# EAGLE design cyberspace-1-ram-rom-card (EAGLE 9.6.2)
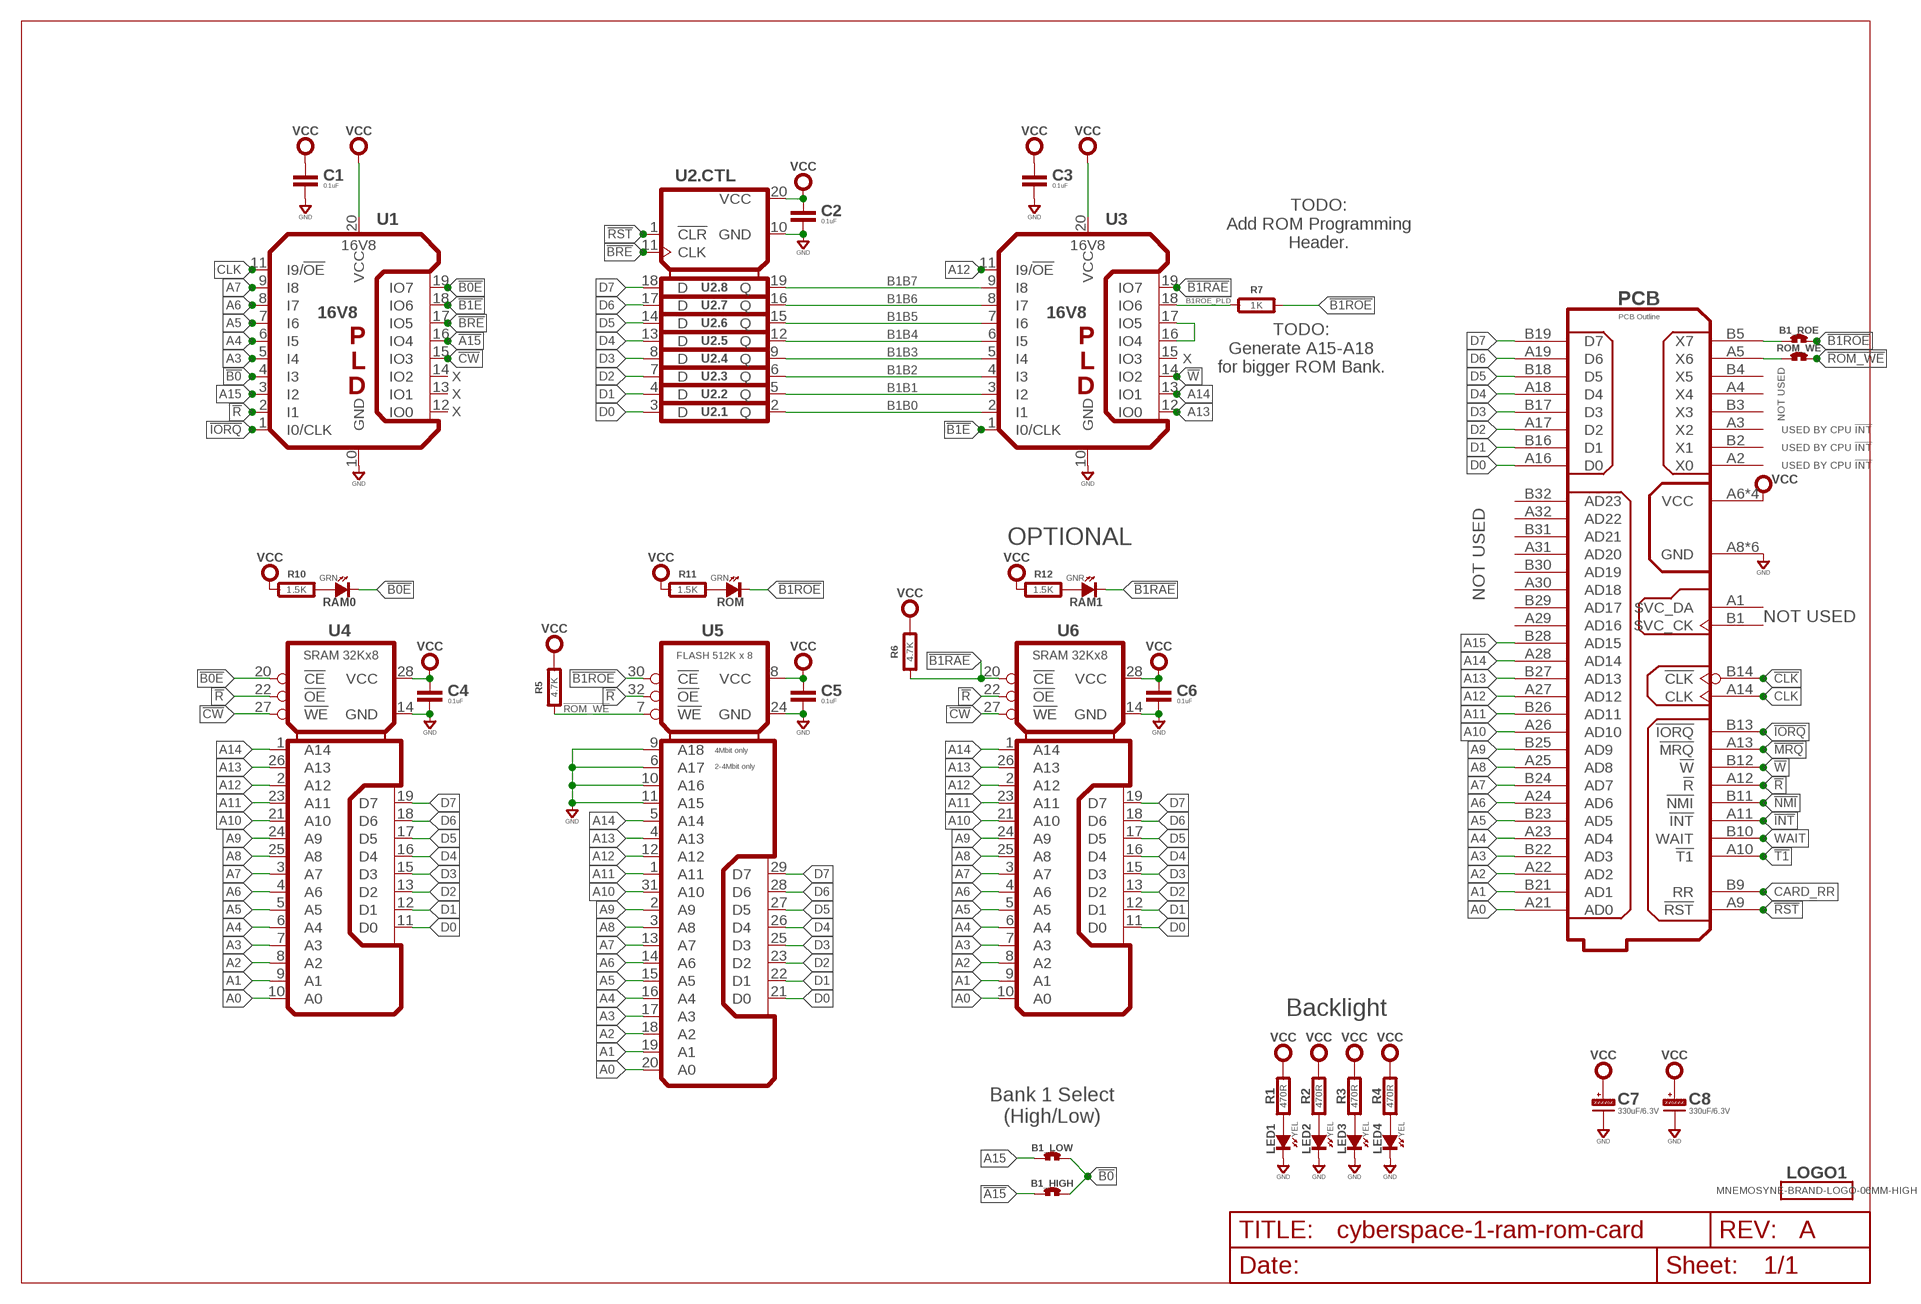
[diagram p0: schematic, sheet 1]
U$1 (DINA4_L-SMALLDOC): REV: A

## Parts
B1_HIGH  SOLDER_JUMPER-60MIL-RND  [SOLDER_JUMP_60MIL_RND]
B1_LOW  SOLDER_JUMPER-60MIL-RND  [SOLDER_JUMP_60MIL_RND]
B1_ROE  SOLDER_JUMPER-60MIL-RND  [SOLDER_JUMP_60MIL_RND]
C1  0.1uF  CAPACITOR0603  [0603-CAP]
C2  0.1uF  CAPACITOR0603  [0603-CAP]
C3  0.1uF  CAPACITOR0603  [0603-CAP]
C4  0.1uF  CAPACITOR0603  [0603-CAP]
C5  0.1uF  CAPACITOR0603  [0603-CAP]
C6  0.1uF  CAPACITOR0603  [0603-CAP]
C7  330uF/6.3V  CAPACITOR_POL-ALUM-SMT-6.3  [CAP_ALUM_SMT_6.3]
C8  330uF/6.3V  CAPACITOR_POL-ALUM-SMT-6.3  [CAP_ALUM_SMT_6.3]
LED1  YEL  SMT0603  [SMD_0603]
LED2  YEL  SMT0603  [SMD_0603]
LED3  YEL  SMT0603  [SMD_0603]
LED4  YEL  SMT0603  [SMD_0603]
LOGO1  MNEMOSYNE-BRAND-LOGO-06MM-HIGH  [MNEMOSYNE-06MM]
PCB  PCB Outline  CYBERSPACE-1-CARD-1A  [CYBERSPACE-CARD-TYPE-1A]
R1  470R  RESISTOR0603  [0603-RES]
R2  470R  RESISTOR0603  [0603-RES]
R3  470R  RESISTOR0603  [0603-RES]
R4  470R  RESISTOR0603  [0603-RES]
R5  4.7K  RESISTOR0603  [0603-RES]
R6  4.7K  RESISTOR0603  [0603-RES]
R7  1K  RESISTOR0603  [0603-RES]
R10  1.5K  RESISTOR0603  [0603-RES]
R11  1.5K  RESISTOR0603  [0603-RES]
R12  1.5K  RESISTOR0603  [0603-RES]
RAM0  GRN  SMT0603  [SMD_0603]
RAM1  GNR  SMT0603  [SMD_0603]
ROM  GRN  SMT0603  [SMD_0603]
ROM_WE  SOLDER_JUMPER-60MIL-RND  [SOLDER_JUMP_60MIL_RND]
U1  16V8  16V8-SOIC  [SOP20]
U2  74AHCT273NS  [SO20]
U3  16V8  16V8-SOIC  [SOP20]
U4  SRAM 32Kx8  62C256UL  [SOP28-330W]
U5  FLASH 512K x 8  FLASH_512KX8-512K-TSOP  [TSOP32-14X8MM]
U6  SRAM 32Kx8  62C256UL  [SOP28-330W]

## Nets
!A15: B1_HIGH.1 U1.16(IO4)
!B0: B1_HIGH.2 B1_LOW.2 U1.4(I3)
!B0E: RAM0.K(C) U1.19(IO7) U4.20(!CE)
!B1E: U1.18(IO6) U3.1(I0/CLK)
!B1RAE: R6.1 RAM1.K(C) U3.19(IO7) U6.20(!CE)
!B1ROE: B1_ROE.2 R7.2 ROM.K(C) U5.30(!CE)
!B1ROE_PLD: R7.1 U3.18(IO6)
!BRE: U1.17(IO5) U2.11(.CTL:CLK)
!CLK: PCB.B14(!CLK)
!CW: U1.15(IO3) U4.27(!WE) U6.27(!WE)
!INT: PCB.A11(!INT)
!IORQ: PCB.B13(!IORQ) U1.1(I0/CLK)
!MRQ: PCB.A13(!MRQ)
!NMI: PCB.B11(!NMI)
!R: PCB.A12(!R) U1.2(I1) U4.22(!OE) U5.32(!OE) U6.22(!OE)
!ROM_WE: R5.1 ROM_WE.2 U5.7(!WE)
!RST: PCB.A9(!RST) U2.1(.CTL:!CLR)
!T1: PCB.A10(!T1)
!W: PCB.B12(!W) U3.14(IO2)
A0: PCB.A21(AD0) U4.10(A0) U5.20(A0) U6.10(A0)
A1: PCB.B21(AD1) U4.9(A1) U5.19(A1) U6.9(A1)
A2: PCB.A22(AD2) U4.8(A2) U5.18(A2) U6.8(A2)
A3: PCB.B22(AD3) U1.5(I4) U4.7(A3) U5.17(A3) U6.7(A3)
A4: PCB.A23(AD4) U1.6(I5) U4.6(A4) U5.16(A4) U6.6(A4)
A5: PCB.B23(AD5) U1.7(I6) U4.5(A5) U5.15(A5) U6.5(A5)
A6: PCB.A24(AD6) U1.8(I7) U4.4(A6) U5.14(A6) U6.4(A6)
A7: PCB.B24(AD7) U1.9(I8) U4.3(A7) U5.13(A7) U6.3(A7)
A8: PCB.A25(AD8) U4.25(A8) U5.3(A8) U6.25(A8)
A9: PCB.B25(AD9) U4.24(A9) U5.2(A9) U6.24(A9)
A10: PCB.A26(AD10) U4.21(A10) U5.31(A10) U6.21(A10)
A11: PCB.B26(AD11) U4.23(A11) U5.1(A11) U6.23(A11)
A12: PCB.A27(AD12) U3.11(I9/!OE) U4.2(A12) U5.12(A12) U6.2(A12)
A13: PCB.B27(AD13) U3.12(IO0) U4.26(A13) U5.4(A13) U6.26(A13)
A14: PCB.A28(AD14) U3.13(IO1) U4.1(A14) U5.5(A14) U6.1(A14)
A15: B1_LOW.1 PCB.B28(AD15) U1.3(I2)
B1B0: U2.2(.1:Q) U3.2(I1)
B1B1: U2.5(.2:Q) U3.3(I2)
B1B2: U2.6(.3:Q) U3.4(I3)
B1B3: U2.9(.4:Q) U3.5(I4)
B1B4: U2.12(.5:Q) U3.6(I5)
B1B5: U2.15(.6:Q) U3.7(I6)
B1B6: U2.16(.7:Q) U3.8(I7)
B1B7: U2.19(.8:Q) U3.9(I8)
CARD_RR: PCB.B9(RR)
CLK: PCB.A14(CLK) U1.11(I9/!OE)
D0: PCB.A16(D0) U2.3(.1:D) U4.11(D0) U5.21(D0) U6.11(D0)
D1: PCB.B16(D1) U2.4(.2:D) U4.12(D1) U5.22(D1) U6.12(D1)
D2: PCB.A17(D2) U2.7(.3:D) U4.13(D2) U5.23(D2) U6.13(D2)
D3: PCB.B17(D3) U2.8(.4:D) U4.15(D3) U5.25(D3) U6.15(D3)
D4: PCB.A18(D4) U2.13(.5:D) U4.16(D4) U5.26(D4) U6.16(D4)
D5: PCB.B18(D5) U2.14(.6:D) U4.17(D5) U5.27(D5) U6.17(D5)
D6: PCB.A19(D6) U2.17(.7:D) U4.18(D6) U5.28(D6) U6.18(D6)
D7: PCB.B19(D7) U2.18(.8:D) U4.19(D7) U5.29(D7) U6.19(D7)
GND: C1.2 C2.2 C3.2 C4.2 C5.2 C6.2 C7.-(N) C8.-(N) LED1.K(C) LED2.K(C) LED3.K(C) LED4.K(C) PCB.A8(GND) PCB.A15(GND) PCB.A20(GND) PCB.B8(GND) PCB.B15(GND) PCB.B20(GND) U1.10(GND) U2.10(.CTL:GND) U3.10(GND) U4.14(GND) U5.6(A17) U5.9(A18) U5.10(A16) U5.11(A15) U5.24(GND) U6.14(GND)
N$1: U3.16(IO4) U3.17(IO5)
N$2: LED1.A R1.1
N$3: LED2.A R2.1
N$4: R10.2 RAM0.A
N$5: LED3.A R3.1
N$6: LED4.A R4.1
N$7: R11.2 ROM.A
N$8: R12.2 RAM1.A
N$9: B1_ROE.1 PCB.B5(X7)
N$10: PCB.A5(X6) ROM_WE.1
VCC: C1.1 C2.1 C3.1 C4.1 C5.1 C6.1 C7.+(P) C8.+(P) PCB.A6(VCC) PCB.A7(VCC) PCB.B6(VCC) PCB.B7(VCC) R1.2 R2.2 R3.2 R4.2 R5.2 R6.2 R10.1 R11.1 R12.1 U1.20(VCC) U2.20(.CTL:VCC) U3.20(VCC) U4.28(VCC) U5.8(VCC) U6.28(VCC)
WAIT: PCB.B10(WAIT)
Unconnected: PCB.A1(SVC_DA) PCB.A2(X0) PCB.A3(X2) PCB.A4(X4) PCB.A29(AD16) PCB.A30(AD18) PCB.A31(AD20) PCB.A32(AD22) PCB.B1(SVC_CK) PCB.B2(X1) PCB.B3(X3) PCB.B4(X5) PCB.B29(AD17) PCB.B30(AD19) PCB.B31(AD21) PCB.B32(AD23) U1.12(IO0) U1.13(IO1) U1.14(IO2) U3.15(IO3)

## Notes on the sheet
- TODO:
  Add ROM Programming
  Header.
- TODO:
  Generate A15-A18
  for bigger ROM Bank.
- X
- X
  X
  X
- NOT USED
- USED BY CPU !INT
- USED BY CPU !INT
- USED BY CPU !INT
- OPTIONAL
- NOT USED
- NOT USED
- Backlight
- Bank 1 Select
  (High/Low)

## Library data of the parts
B1_HIGH B1_LOW B1_ROE ROM_WE = rlc:SOLDER_JUMPER: Solder Jumper 60mil (2mm dia.), Round
C1-C6 = rlc:CAPACITOR: Capacitor; COST01: 0.12; COST10: 0.09; COST100: 0.05
C7 C8 = rlc:CAPACITOR_POL: Polarized Capacitor; COST01: 0.52; COST10: 0.35; COST100: 0.22
LED1-LED4 RAM0 RAM1 ROM = led:SMT: LED SMT; COST01: 0.20; COST10: 0.17; COST100: 0.14
LOGO1 = gfx-glyphs:MNEMOSYNE-BRAND-LOGO: Mnemosyne Brand Logo
PCB = con-edge:CYBERSPACE-1-CARD: Card for the CyberSpace 1 System
R1-R7 R10-R12 = rlc:RESISTOR: Resistor; COST01: 0.10; COST10: 0.05; COST100: 0.02
U1 U3 = logic:16V8: 16V8 Programmable Logic Device (PLD); COST01: 1.30; COST10: 1.15; COST100: 1.10; MFR: Atmel; MPN: AF16V8B15SU
U2 = logic:74*273?: Octal D-type Flip Flop
U4 U6 = logic:62*256: SRAM - 32Kx8 (256K); COST01: 1.50; COST10: 1.23; COST100: 1.10; MFR: ISSI; MPN: IS62C256AL-45UL
U5 = logic:FLASH_512KX8: Flash - 8 bit parallel, up to 512Kx8; COST01: 2.30; COST10: 2.10; COST100: 1.80; MFR: Microchip; MPN: SST39SF040-70-4C-Wxx

## Board
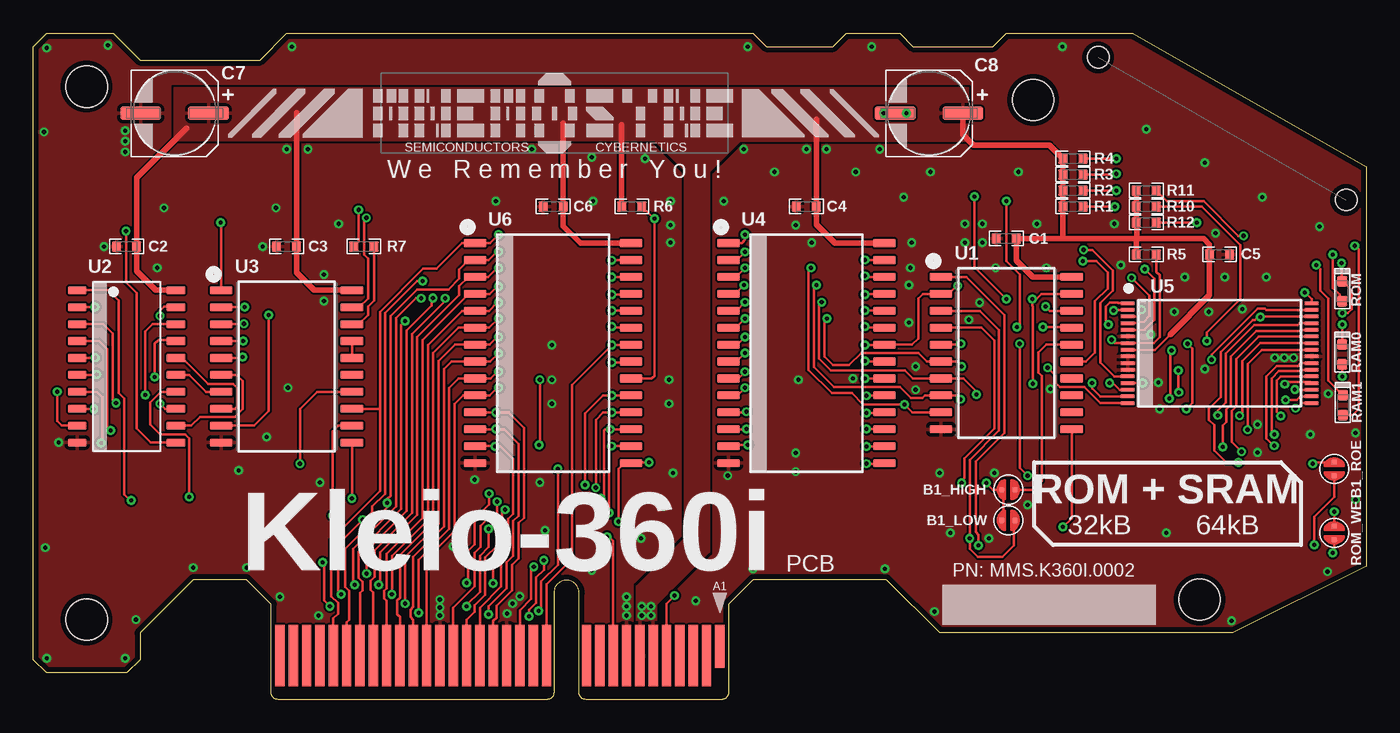
[diagram p1: board, top side]
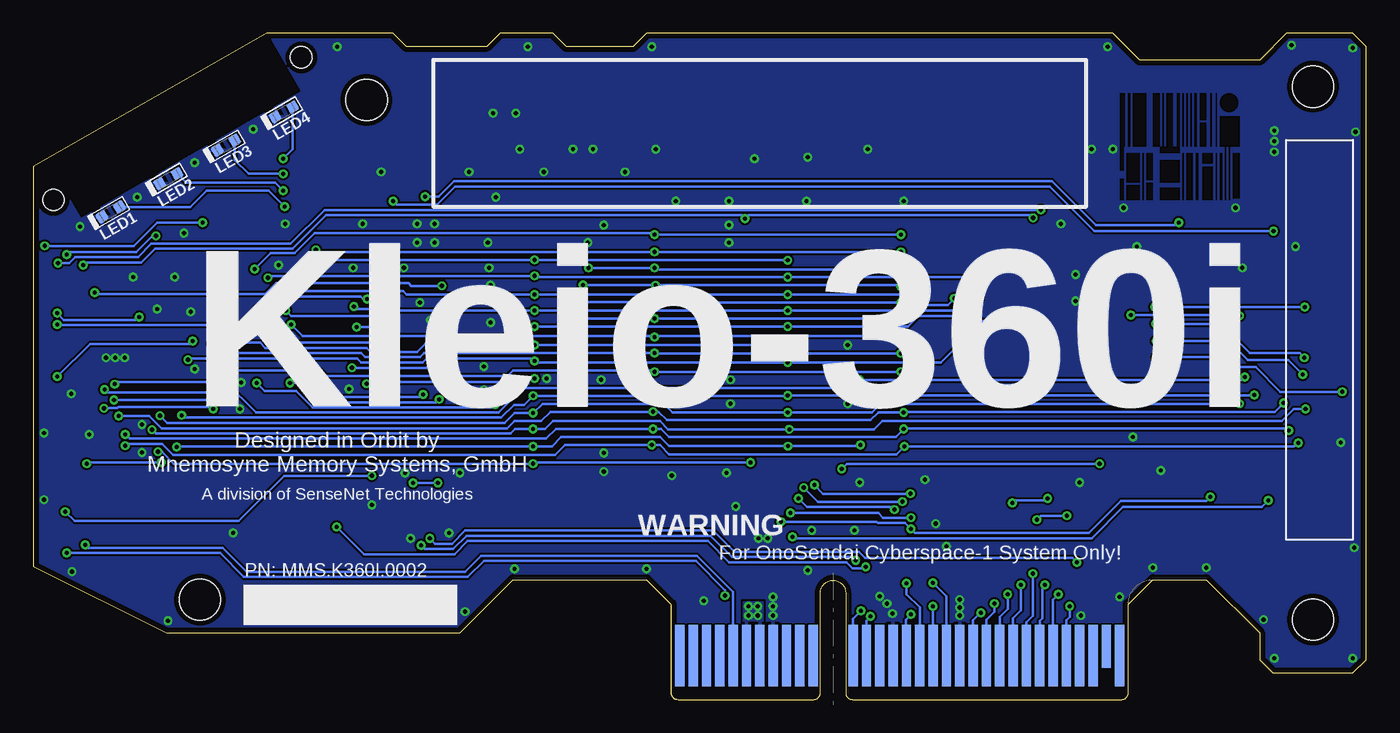
[diagram p2: board, bottom side, seen from below]

Size 100 x 50 mm. Coordinates in mm from the lower left corner, seen from the top.
Copper layers (1*16): Top 0.0356mm / dielectric 1.5011mm / Bottom 0.0356mm
Design rules "OSH-CircuitMonkey": minimum track width 6mil, minimum drill 12mil, track to track 6mil, track to pad 6mil, pad to pad 6mil, via to via 6mil, smd to smd 6mil, copper to edge 15mil, drill to drill 6mil, minimum pad ring 7mil, minimum via ring 7mil, stop-mask expansion 3mil, vias tented up to drill 13mil, thermal gap 10mil
Holes 1.6 mm at 79.9,48.2 98.5,37.5
bRestrict: area 79.9,36.2 to 98.7,49.5; area 18.1,41.5 to 18.5,45.5; area 16.5,41.5 to 17.5,45.5; area 15.5,41.5 to 16,45.5; area 14.5,41.5 to 15,45.5; area 12,43.5 to 12.5,45.5; area 9.5,41.5 to 11,43.8; area 17,37.5 to 18,38.6; area 16,39 to 16.5,41; area 14,41 to 15.5,41.5; area 13,37.5 to 13.5,41; area 11.5,37.5 to 12.3,40; area 9.5,37.6 to 10,41; area 17.7,41.5 to 17.9,45.5; area 15.2,41.4 to 15.3,45.5; area 14,41.5 to 14.2,45.5; area 13.1,41.5 to 13.2,45.5; area 12.7,41.5 to 12.9,45.5; area 13.4,41.5 to 13.5,45.5; area 13.7,41.5 to 13.8,45.5; area 11.2,41.5 to 11.3,45.5; area 11.6,41.5 to 11.7,45.5; area 13.7,37.5 to 13.8,41; area 12.6,37.5 to 12.8,41; area 11.2,37.5 to 11.3,41; area 10.8,37.5 to 11,41; area 10.5,37.5 to 10.6,41.5; area 10.2,37.5 to 10.3,41.5; area 18.2,39.7 to 18.5,41.5; area 18.2,37.5 to 18.5,39.1; area 16,37.5 to 16.5,38.8; area 17,38.8 to 18,41; area 16.7,37.5 to 16.8,41; area 12,41.5 to 12.5,43.3; area 11.5,40.2 to 12.3,41; area 14,38.8 to 15.5,40.5; area 14,37.5 to 15.5,38.4; area 9.6,44.1 to 11,45.5

### Footprints (pad centres in the part's own frame; a part is rotated, then mirrored left to right if it is on the bottom)
SOLDER_JUMP_60MIL_RND = smd 0.406 x 0.406: 1 -0.508,0; 2 0.508,0
0603-CAP = smd 0.711 x 0.762: 1 -0.752,0; 2 0.752,0
CAP_ALUM_SMT_6.3 = smd 3.048 x 1.016: + 2.54,0; - -2.54,0
SMD_0603 = smd 0.8 x 0.8: A 0.75,0; K -0.75,0
CYBERSPACE-CARD-TYPE-1A = smd 0.7 x 3.2: A1 11.5,4 | smd 0.7 x 4.6: A2 10.5,3.3; A3 9.5,3.3; A4 8.5,3.3; A5 7.5,3.3; A6 6.5,3.3; A7 5.5,3.3; A8 4.5,3.3; A9 3.5,3.3; A10 2.5,3.3; A11 1.5,3.3; A12 -1.5,3.3; A13 -2.5,3.3; A14 -3.5,3.3; A15 -4.5,3.3; A16 -5.5,3.3; A17 -6.5,3.3; A18 -7.5,3.3; A19 -8.5,3.3; A20 -9.5,3.3; A21 -10.5,3.3; A22 -11.5,3.3; A23 -12.5,3.3; A24 -13.5,3.3; A25 -14.5,3.3; A26 -15.5,3.3; A27 -16.5,3.3; A28 -17.5,3.3; A29 -18.5,3.3; A30 -19.5,3.3; A31 -20.5,3.3; A32 -21.5,3.3 | smd 0.7 x 4.6 bottom: B1 11.5,3.3; B2 10.5,3.3; B3 9.5,3.3; B4 8.5,3.3; B5 7.5,3.3; B6 6.5,3.3; B7 5.5,3.3; B8 4.5,3.3; B9 3.5,3.3; B10 2.5,3.3; B11 1.5,3.3; B12 -1.5,3.3; B13 -2.5,3.3; B14 -3.5,3.3; B15 -4.5,3.3; B16 -5.5,3.3; B17 -6.5,3.3; B18 -7.5,3.3; B19 -8.5,3.3; B20 -9.5,3.3; B21 -10.5,3.3; B22 -11.5,3.3; B23 -12.5,3.3; B24 -13.5,3.3; B25 -14.5,3.3; B26 -15.5,3.3; B27 -16.5,3.3; B28 -17.5,3.3; B29 -18.5,3.3; B30 -19.5,3.3; B32 -21.5,3.3 | smd 0.7 x 3.2 bottom: B31 -20.5,4 | hole 3.1: -36,46; -36,6; 47.5,7.5; 35,45
0603-RES = smd 0.711 x 0.762: 1 -0.752,0; 2 0.752,0
SOP20 = smd 0.6 x 1.7: 1 -5.715,-4.9; 2 -4.445,-4.9; 3 -3.175,-4.9; 4 -1.905,-4.9; 5 -0.635,-4.9; 6 0.635,-4.9; 7 1.905,-4.9; 8 3.175,-4.9; 9 4.445,-4.9; 10 5.715,-4.9; 11 5.715,4.9; 12 4.445,4.9; 13 3.175,4.9; 14 1.905,4.9; 15 0.635,4.9; 16 -0.635,4.9; 17 -1.905,4.9; 18 -3.175,4.9; 19 -4.445,4.9; 20 -5.715,4.9
SO20 = smd 0.6 x 1.4: 1 -5.715,-3.7; 2 -4.445,-3.7; 3 -3.175,-3.7; 4 -1.905,-3.7; 5 -0.635,-3.7; 6 0.635,-3.7; 7 1.905,-3.7; 8 3.175,-3.7; 9 4.445,-3.7; 10 5.715,-3.7; 11 5.715,3.7; 12 4.445,3.7; 13 3.175,3.7; 14 1.905,3.7; 15 0.635,3.7; 16 -0.635,3.7; 17 -1.905,3.7; 18 -3.175,3.7; 19 -4.445,3.7; 20 -5.715,3.7
SOP28-330W = smd 0.6 x 1.7: 1 -8.255,-5.85; 2 -6.985,-5.85; 3 -5.715,-5.85; 4 -4.445,-5.85; 5 -3.175,-5.85; 6 -1.905,-5.85; 7 -0.635,-5.85; 8 0.635,-5.85; 9 1.905,-5.85; 10 3.175,-5.85; 11 4.445,-5.85; 12 5.715,-5.85; 13 6.985,-5.85; 14 8.255,-5.85; 15 5.715,5.85; 16 4.445,5.85; 17 8.255,5.85; 18 6.985,5.85; 19 3.175,5.85; 20 1.905,5.85; 21 0.635,5.85; 22 -0.635,5.85; 23 -1.905,5.85; 24 -3.175,5.85; 25 -4.445,5.85; 26 -5.715,5.85; 27 -6.985,5.85; 28 -8.255,5.85
TSOP32-14X8MM = smd 0.27 x 1.1: 1 -3.75,-6.9; 2 -3.25,-6.9; 3 -2.75,-6.9; 4 -2.25,-6.9; 5 -1.75,-6.9; 6 -1.25,-6.9; 7 -0.75,-6.9; 8 -0.25,-6.9; 9 0.25,-6.9; 10 0.75,-6.9; 11 1.25,-6.9; 12 1.75,-6.9; 13 2.25,-6.9; 14 2.75,-6.9; 15 3.25,-6.9; 16 3.75,-6.9; 17 3.75,6.9; 18 3.25,6.9; 19 2.75,6.9; 20 2.25,6.9; 21 1.75,6.9; 22 1.25,6.9; 23 0.75,6.9; 24 0.25,6.9; 25 -0.25,6.9; 26 -0.75,6.9; 27 -1.25,6.9; 28 -1.75,6.9; 29 -2.25,6.9; 30 -2.75,6.9; 31 -3.25,6.9; 32 -3.75,6.9

### Placement (x,y rotation side)
B1_HIGH  73.15,15.75 180 top
B1_LOW  73.15,13.45 180 top
B1_ROE  97.6,17.3 90 top
C1  73,34.6 180 top
C2  7,34 180 top
C3  19,34 180 top
C4  58,37 180 top
C5  89,33.4 0 top
C6  39,37 180 top
C7  10.6,44 0 top
C8  67.2,44 0 top
LED1  94.19,36.6 30 bottom
LED2  89.86,39.1 30 bottom
LED3  85.53,41.6 30 bottom
LED4  81.2,44.1 30 bottom
LOGO1  39.1,44 0 top
PCB  40,0 0 top
R1  78,37 180 top
R2  78,38.2 180 top
R3  78,39.4 180 top
R4  78,40.6 180 top
R5  83.5,33.4 180 top
R6  44.9,37 180 top
R7  24.8,34 180 top
R10  83.5,37 0 top
R11  83.5,38.2 0 top
R12  83.5,35.8 0 top
RAM0  98.2,25.9 270 top
RAM1  98.25,22.1 270 top
ROM  98.2,30.65 270 top
ROM_WE  97.6,12.5 90 top
U1  73,26 270 top
U2  7,25 270 top
U3  19,25 270 top
U4  58,26 270 top
U5  89,26 270 top
U6  39,26 270 top

### Tracks (layer width: path | path; a pad name or v marks a point on that pad's centre or on a via)
!A15
  Top 0.2: U1.16 77.89,26.65 76,26.65 75.4,26.05 75.4,24.55 75.65,24.3 75.65,16.4 75,15.75 B1_HIGH.1
!B0  (via drill 0.3)
  Top 0.2: B1_LOW.2 72.79,13.6 72.79,15.6 B1_HIGH.2 72,15.75 v71.5,16.25 | v69.65,16.25 69.65,16.45 69.85,16.65 69.85,18.1 72.1,20.35 72.1,26.95 71.14,27.91 U1.4
  Bottom 0.2: v71.5,16.25 v69.65,16.25
!B0E  (via drill 0.3)
  Top 0.2: U4.20 v62.41,24.09 v62.4,24.1 | v98.2,28.15 RAM0.K | v75,23.7 75,29.5 74.95,29.55 v74.95,30.05 75.25,30.05 75.64,30.45 U1.19
  Bottom 0.2: v62.4,24.1 63.95,24.1 64.2,23.85 74.85,23.85 v75,23.7 | v98.2,28.15 98.15,28.1 82.85,28.1 82.5,28.45 82.5,29.3 81.55,30.25 75.45,30.25 75.25,30.05 v74.95,30.05
!B1E  (via drill 0.3)
  Top 0.2: U1.18 76.28,29.18 v75.95,29.5 | v73,30.07 70.6,32.47 v70.6,37.75 | v14.05,35.8 14.1,35.75 U3.1
  Bottom 0.2: v75.95,29.5 75.75,29.3 74.4,29.3 73.63,30.07 v73,30.07 | v70.6,37.75 69.6,37.75 68.45,38.9 23.6,38.9 20.3,35.6 14.25,35.6 v14.05,35.8
!B1RAE  (via drill 0.3)
  Top 0.2: R6.1 46.55,36.1 v46.6,36.1 46.6,24.3 46.4,24.09 U6.20 | U3.19 24.45,29.45 25.1,30.1 25.1,33.1 24.8,33.4 24.8,35.96 v24.99,36.15 | v96.25,32.6 96.55,32.3 96.55,30.7 97.15,30.1 97.15,23.95 RAM1.K
  Bottom 0.2: v24.99,36.15 25.19,36.35 46.35,36.35 v46.6,36.1 46.85,36.35 78.05,36.35 80.55,33.85 90.85,33.85 91.9,32.8 96.05,32.8 v96.25,32.6
!B1ROE  (via drill 0.3)
  Top 0.2: v98.15,32.75 98.15,31.45 ROM.K 98.9,30.7 98.9,29.3 98.6,29 v98.2,29 | U5.30 92.1,28.75 v92.05,28.7 91.85,28.7 91.65,28.5 91.5,28.5 89.1,26.1 89.1,22.7 88.2,21.8 88.2,21 88.6,20.6 88.6,18.7 89.51,17.79 v90.4,17.79 | v24.4,36.75 24.4,34.35 R7.2 | v96,17.7 96.11,17.81 B1_ROE.2
  Bottom 0.2: v98.15,32.75 97.3,32.75 96.85,33.2 92.15,33.2 91.15,34.2 80.7,34.2 78.15,36.75 v24.4,36.75 | v92.05,28.7 92.1,28.75 92.35,28.5 97.7,28.5 v98.2,29 | v90.4,17.79 95.91,17.79 v96,17.7
!B1ROE_PLD
  Top 0.2: R7.1 25.55,29.95 25.1,29.5 25.1,28.88 24.4,28.18 U3.18
!BRE  (via drill 0.3)
  Top 0.2: v73.8,27.95 74,28.15 74,31.9 73,32.9 v73,37.4 | v75.75,27.95 77.86,27.95 U1.17 | v6.95,35.15 6.95,31.3 7.75,30.5 7.75,20.35 8.81,19.29 U2.11
  Bottom 0.2: v73,37.4 72.75,37.15 69.7,37.15 68.35,38.5 23.75,38.5 20.4,35.15 v6.95,35.15 | v73.8,27.95 v75.75,27.95
!CW  (via drill 0.3)
  Top 0.2: U6.27 43.42,32.98 v43.4,32.97 | v62.4,33 63.84,33 U4.27 | v78.75,32.9 79.75,32.9 80.6,32.05 80.6,30.85 79.65,29.9 79.65,26.05 78.97,25.36 U1.15
  Bottom 0.2: v43.4,32.97 53.14,32.97 53.16,32.98 62.38,32.98 v62.4,33 78.65,33 v78.75,32.9
!IORQ  (via drill 0.3)
  Top 0.2: v70.9,11.57 70.9,12.37 70.7,12.57 70.7,17.87 72.85,20.02 72.85,28.85 70,31.7 68.11,31.7 U1.1 | v38.3,10.43 38.3,9.75 37.7,9.15 37.7,7.26 37.19,6.74 v37.19,6.24 v37.18,6.23
  Bottom 0.2: v70.9,11.57 70.63,11.3 68.5,11.3 67.5,12.3 49.2,12.3 47.6,10.7 38.57,10.7 v38.3,10.43 | PCB.B13 37.5,5.9 37.18,6.22 v37.18,6.23
!R  (via drill 0.3)
  Top 0.2: U6.22 44.83,26.62 v43.4,26.62 40.4,23.62 40.4,10.55 38.5,8.65 PCB.A12 | v62.4,26.6 63.81,26.6 U4.22 65.94,26.64 66.4,27.1 66.4,30.1 66.75,30.45 U1.2 68.64,30.45 69.25,31.05 v69.35,31.05 | v95.4,30.55 95.9,30.05 U5.32
  Bottom 0.2: v43.4,26.62 62.38,26.62 v62.4,26.6 | v69.35,31.05 71.65,31.05 71.85,31.25 81.8,31.25 82.6,30.45 95.3,30.45 v95.4,30.55
!ROM_WE  (via drill 0.3)
  Top 0.2: R5.1 84.25,32.1 84.5,31.85 84.5,27.2 84.05,26.75 U5.7 81.15,26.75 v80.9,27 | v74,26.7 74,20.5 74,20.4 74,17.4 v74.6,16.8 | v97.6,14.1 ROM_WE.2
  Bottom 0.2: v80.9,27 80.7,26.8 74.1,26.8 v74,26.7 | v74.6,16.8 81.2,16.8 84.6,13.4 96.9,13.4 v97.6,14.1
!RST  (via drill 0.3)
  Top 0.2: U2.1 5.63,30.71 6.4,29.95 6.4,23 6.8,22.6 6.8,15.4 7.25,14.95 v7.35,14.95 | v43.05,12.2 43.2,12.2 43.5,11.9 PCB.A9
  Bottom 0.2: v7.35,14.95 7.85,14.45 18.25,14.45 20.6,12.1 42.95,12.1 v43.05,12.2
!W  (via drill 0.3)
  Top 0.2: U3.14 21.3,23.09 20,21.8 v20,17.7 | v37.92,6.65 37.92,6.67 38.1,6.85 38.1,8.85 39.35,10.1 v39.35,17.3
  Bottom 0.2: v20,17.7 38.95,17.7 v39.35,17.3 | PCB.B12 38.5,6.06 v37.92,6.64 v37.92,6.65
A0  (via drill 0.3)
  Top 0.2: PCB.A21 29.5,10.55 31.6,12.65 31.6,22.2 32.23,22.82 U6.10 34.23,22.82 34.8,23.4 v34.9,23.4 | v53.4,23.4 52.83,22.82 U4.10 | U5.20 95.8,23.85 94.08,23.85 v93.9,23.67
  Bottom 0.2: v34.9,23.4 v53.4,23.4 63.25,23.4 65.1,21.55 83.3,21.55 85.59,23.84 93.73,23.84 v93.9,23.67
A1  (via drill 0.3)
  Top 0.2: v28.9,6.5 28.9,10.5 31.2,12.8 31.2,23.4 31.89,24.09 U6.9 34.3,24.09 34.8,24.6 v34.9,24.6 | U4.9 52.9,24.09 v53.4,24.6 | U5.19 v94.67,23.25 v94.66,23.26 | v85.95,23.06 85.9,23.11 v85.9,24.7
  Bottom 0.2: PCB.B21 29.5,5.95 28.95,6.5 v28.9,6.5 | v34.9,24.6 v53.4,24.6 53.5,24.7 64,24.7 64.4,24.3 78.05,24.3 78.45,24.7 v85.9,24.7 | v94.66,23.26 94.46,23.06 v85.95,23.06
A2  (via drill 0.3)
  Top 0.2: PCB.A22 28.5,6 28.3,6.2 28.3,6.75 28.5,6.95 28.5,10.7 30.8,13 30.8,24.8 31.36,25.36 U6.8 34.28,25.36 v34.9,25.98 | v53.4,26 52.77,25.36 U4.8 | U5.18 95.06,22.75 94.78,22.48 v93.95,22.48 | v85.4,26.2 85.3,26.1 85.3,22.65 v85.24,22.59
  Bottom 0.2: v34.9,25.98 53.38,25.98 v53.4,26 70.7,26 71,25.7 75.1,25.7 75.4,26 85.2,26 v85.4,26.2 | v93.95,22.48 85.42,22.48 85.31,22.59 v85.24,22.59
A3  (via drill 0.3)
  Top 0.2: v27.9,7.2 27.9,10.7 30.4,13.2 30.4,25.4 31.64,26.64 U6.7 34.23,26.64 34.8,27.2 v34.9,27.2 | U4.7 52.84,26.64 v53.4,27.2 | U5.17 95.15,22.25 94.8,21.9 94.74,21.9 v94.7,21.86 | v69.6,26.7 69.53,26.64 U1.5 | v86.6,26.7 86.95,26.35 86.95,22.25 v86.5,21.8
  Bottom 0.2: PCB.B22 28.5,6 27.9,6.6 v27.9,7.2 | v34.9,27.2 34.9,27.3 53.3,27.3 v53.4,27.2 53.5,27.3 63.4,27.3 64,26.7 v69.6,26.7 70.6,26.7 71.2,26.1 74.7,26.1 75,26.4 82.6,26.4 83,26.8 86.5,26.8 v86.6,26.7 | v94.7,21.86 93.7,21.86 93.6,21.96 86.66,21.96 v86.5,21.8 | v86.5,21.8
A4  (via drill 0.3)
  Top 0.2: PCB.A23 27.5,6.2 27.3,6.4 27.3,7.45 27.5,7.65 27.5,10.85 30,13.35 30,26 31.91,27.91 U6.6 34.2,27.91 v34.9,28.6 | v53.4,28.6 52.7,27.91 U4.6 | v59.55,28.6 59.35,28.4 59.35,25.75 60,25.1 61.2,25.1 62.12,26.02 66.4,26.02 67.05,25.36 U1.6 69.39,25.36 69.65,25.1 v69.65,25 | v76.1,24.9 76.7,24.3 76.7,23.75 77,23.45 78.85,23.45 80.05,22.25 U5.16
  Bottom 0.2: v34.9,28.6 v53.4,28.6 v59.55,28.6 | v76.1,24.9 70.55,24.9 70.25,25.2 69.85,25.2 v69.65,25
A5  (via drill 0.3)
  Top 0.2: v26.9,7.9 26.9,10.8 29.6,13.5 29.6,26.6 32.17,29.18 U6.5 34.17,29.18 34.8,29.8 v34.9,29.8 | v53.4,29.82 52.76,29.18 U4.5 | U5.15 80.05,22.75 79.44,23.36 v79.44,23.76 | v59.15,29.82 58.95,29.62 58.95,25.6 59.85,24.7 65.4,24.7 66,24.09 U1.7 69.79,24.09 70.75,23.13 v70.75,22.88
  Bottom 0.2: PCB.B23 27.5,6.2 26.9,6.8 v26.9,7.9 | v34.9,29.8 53.38,29.8 v53.4,29.82 v59.15,29.82 | v79.44,23.76 79.44,23.56 78.58,22.7 71.05,22.7 70.87,22.88 v70.75,22.88
A6  (via drill 0.3)
  Top 0.2: PCB.A24 26.5,7.4 26.3,7.6 26.3,8.15 26.5,8.35 26.5,10.95 29.2,13.65 29.2,27 32.65,30.45 U6.4 34.24,30.45 34.8,31 v34.9,31 | v53.31,31.09 52.66,30.45 U4.4 | v69.55,22.53 69.26,22.82 U1.8 66.9,22.82 66.7,22.62 65.83,22.62 65,23.45 60.05,23.45 58.55,24.95 58.55,30.9 v58.75,31.1 | v80.75,23.75 81,23.75 81.5,23.25 U5.14
  Bottom 0.2: v34.9,31 35,31.1 v53.3,31.1 v53.31,31.09 v58.75,31.1 | v69.55,22.53 69.78,22.3 78.8,22.3 80.25,23.75 v80.75,23.75
A7  (via drill 0.3)
  Top 0.2: v25.9,8.6 26,8.7 26,11.05 28.8,13.85 28.8,27.2 31.95,30.35 31.95,31.02 32.65,31.71 U6.3 34.13,31.71 34.8,32.38 v34.9,32.38 | v53.4,32.4 52.72,31.71 U4.3 | U1.9 65.94,21.55 v65.35,22.15 62.25,22.15 61.4,23 59.9,23 58.15,24.75 58.15,32.2 v58.35,32.4 | U5.13 v83.25,23.75
  Bottom 0.2: PCB.B24 26.5,6.1 25.9,6.7 v25.9,8.6 | v34.9,32.38 35,32.28 53.28,32.28 v53.4,32.4 v58.35,32.4 | v83.25,23.75 82.65,23.15 80.3,23.15 79.05,21.9 65.6,21.9 v65.35,22.15
A8  (via drill 0.3)
  Top 0.2: PCB.A25 25.5,8.05 25.3,8.25 25.3,8.9 25.6,9.2 25.6,11.2 28.4,14 28.4,27.42 30.89,29.91 v30.89,30.11 | U6.25 44.8,30.4 v43.4,30.4 | U4.25 62.45,30.45 v62.4,30.4 | v83.15,29.25 83.15,29.1 82.8,28.75 U5.3
  Bottom 0.2: v30.89,30.11 31.39,29.61 33.69,29.61 34.48,30.4 v43.4,30.4 v62.4,30.4 72,30.4 72.25,30.65 81.8,30.65 83.15,29.3 v83.15,29.25
A9  (via drill 0.3)
  Top 0.2: v25,9.45 25,11.15 28,14.15 28,27.68 29.88,29.55 29.88,30.02 v29.98,30.12 | v43.4,29.2 44.83,29.2 U6.24 | v62.4,29.2 63.83,29.2 U4.24 | v81.05,29.2 81.05,29.25 U5.2
  Bottom 0.2: PCB.B25 25.5,5.8 25,6.3 v25,9.45 | v29.98,30.12 30.9,29.2 v43.4,29.2 v62.4,29.2 73.55,29.2 73.95,28.8 80.65,28.8 v81.05,29.2
A10  (via drill 0.3)
  Top 0.2: PCB.A26 24.5,8 24.7,8.2 24.7,8.85 24.4,9.15 24.4,11.1 27.6,14.3 27.6,28.1 v27.9,28.4 | U6.21 44.78,25.3 v43.4,25.3 | U4.21 62.44,25.36 v62.4,25.4 | v88.4,25.5 88.4,25.9 91.85,29.35 92.4,29.35 92.5,29.25 U5.31
  Bottom 0.2: v27.9,28.4 28.8,28.4 31.9,25.3 v43.4,25.3 62.3,25.3 v62.4,25.4 62.6,25.6 70.5,25.6 70.8,25.3 75.4,25.3 75.7,25.6 88.3,25.6 v88.4,25.5
A11  (via drill 0.3)
  Top 0.2: v24.1,8.6 24,8.7 24,11.3 27.2,14.5 27.2,28.61 28.7,30.11 v29.1,30.11 | v43.4,28 43.4,27.95 43.45,27.91 U6.23 | U4.23 62.49,27.91 v62.4,28 | U5.1 81.4,29.75 81.35,29.8 80.75,29.8 80.45,29.5 80.45,28.35 v80.65,28.15
  Bottom 0.2: PCB.B26 24.5,5.9 24.3,6.1 24.3,8.4 v24.1,8.6 | v29.1,30.11 v29.1,30.1 30.4,28.8 33.6,28.8 34.4,28 v43.4,28 v62.4,28 63.5,28 64.22,27.28 79.78,27.28 v80.65,28.15
A12  (via drill 0.3)
  Top 0.2: PCB.A27 23.5,5.8 23.7,6 23.7,8.15 23.4,8.45 23.4,11.3 26.6,14.5 26.6,14.7 v26.55,14.75 26.55,15.05 26.8,15.3 26.8,28.8 28.79,30.79 31.15,30.79 31.95,31.59 31.95,32.28 32.65,32.98 U6.2 34.15,32.98 34.77,33.6 v34.9,33.6 | v53.4,33.6 52.78,32.98 U4.2 | U3.11 v23.9,15.1 | U5.12 81.1,24.25 80.05,25.3 80.05,29.75 81,30.7 81,32.2 79.45,33.75 v78.8,33.75
  Bottom 0.2: v34.9,33.6 v53.4,33.6 78.7,33.6 78.8,33.7 v78.8,33.75 | v23.9,15.1 24.05,14.95 26.35,14.95 v26.55,14.75
A13  (via drill 0.3)
  Top 0.2: v23.1,7.9 22.85,8.15 22.85,11.65 v24.7,13.5 24.7,13.4 25.4,14.1 25.4,14.49 26.4,15.45 26.4,29 28.8,31.4 v29.2,31.4 | U6.26 43.4,31.71 v43.4,31.7 | U4.26 62.48,31.71 v62.4,31.8 | U3.12 22.9,20.55 22.45,20.11 v22.45,13.8 | U5.4 82.95,28.25 83.05,28.35 83.32,28.35 83.75,28.77 83.75,30.3 v82.4,31.65
  Bottom 0.2: PCB.B27 23.5,7.5 v23.1,7.9 | v29.2,31.4 29.5,31.7 v43.4,31.7 62.3,31.7 v62.4,31.8 82.3,31.8 82.4,31.7 v82.4,31.65 | v24.7,13.5 24.4,13.8 v22.45,13.8
A14  (via drill 0.3)
  Top 0.2: PCB.A28 22.5,6.1 22.85,6.45 22.85,7.25 22.35,7.75 22.35,12 26,15.65 26,21.9 | 26,21.9 26,29.1 29.25,32.35 30.25,32.35 32.15,34.26 U6.1 34.26,34.26 v34.9,34.9 | v53.4,34.9 53.4,34.51 53.15,34.26 U4.1 | U3.13 25.93,21.82 26,21.9 | v83.4,32.3 84.1,31.6 84.1,28.5 83.35,27.75 U5.5
  Bottom 0.2: v34.9,34.9 v53.4,34.9 53.5,35 78.9,35 80.4,33.5 82.2,33.5 v83.4,32.3
A15  (via drill 0.3)
  Top 0.2: U1.3 71.03,29.18 72.45,27.75 72.45,20.2 70.25,18 v70.25,12.1 70.25,11.3 70.85,10.7 72.7,10.7 73.56,11.56 73.56,13.35 B1_LOW.1 | v21.7,10.3 21.8,10.2 21.8,7.45 v22.25,7
  Bottom 0.2: PCB.B28 22.5,5.95 22.25,6.2 v22.25,7 | v70.25,12.1 69.85,11.7 68.6,11.7 67.6,12.7 49,12.7 47.4,11.1 38.05,11.1 37.6,10.65 22.05,10.65 v21.7,10.3
B1B0  (via drill 0.3)
  Top 0.2: U2.2 v4.6,29.45 | v15.85,29.45 U3.2
  Bottom 0.2: v4.6,29.45 v15.85,29.45
B1B1  (via drill 0.3)
  Top 0.2: U2.5 4.63,25.64 v4.65,25.65 | v15.8,28.2 15.78,28.18 U3.3
  Bottom 0.2: v4.65,25.65 5,26 8.75,26 10.95,28.2 v15.8,28.2
B1B2  (via drill 0.3)
  Top 0.2: U2.6 4.71,24.36 v4.75,24.4 | v15.75,26.9 U3.4
  Bottom 0.2: v4.75,24.4 5.85,25.5 8.9,25.5 10.3,26.9 v15.75,26.9
B1B3  (via drill 0.3)
  Top 0.2: U3.5 15.63,25.64 v15.7,25.7 | v1.8,23.1 1.8,20.9 2.15,20.55 U2.9
  Bottom 0.2: v15.7,25.7 10.7,25.7 9.95,24.95 8.3,24.95 6.45,23.1 v1.8,23.1
B1B4
  Top 0.2: U2.12 11.86,20.55 12.5,21.2 15.1,21.2 15.7,21.8 15.7,23.9 15.23,24.36 U3.6
B1B5
  Top 0.2: U2.15 11.69,24.36 12.96,23.09 U3.7
B1B6
  Top 0.2: U2.16 11.16,25.64 13.1,23.7 15,23.7 15.3,23.4 15.3,22 15.12,21.82 U3.8
B1B7  (via drill 0.3)
  Top 0.2: U3.9 16.55,20.55 17.65,21.65 v17.65,28.85 | v9.5,28.8 9.5,29.2 9.8,29.5 10.64,29.5 U2.19
  Bottom 0.2: v9.5,28.8 9.55,28.85 v17.65,28.85
CLK  (via drill 0.3)
  Top 0.2: PCB.A14 36.5,6.7 37.35,7.55 37.35,9.75 v37.55,9.95 | v77.25,12.95 77.9,13.6 U1.11
  Bottom 0.2: v37.55,9.95 37.65,9.85 38.55,9.85 39,10.3 47.8,10.3 49.4,11.9 67.4,11.9 68.4,10.9 75.2,10.9 v77.25,12.95
D0  (via drill 0.3)
  Top 0.2: PCB.A16 34.5,5.9 34.75,6.15 34.75,7.05 35.9,8.2 35.9,10.1 36.4,10.6 36.4,13.25 36.8,13.65 36.8,20.4 35.65,21.55 v34.7,21.55 U6.11 | v6.2,22.25 5.95,22.5 5.95,27.48 5.25,28.18 U2.3 | U4.11 53.45,21.55 v53.5,21.6 | U5.21 93.6,24.25 93.28,23.93 93.28,21.58 v93.58,21.28
  Bottom 0.2: v6.2,22.25 6.85,21.6 34.6,21.6 v34.7,21.55 36.6,21.55 37.18,20.97 52.47,20.97 53.1,21.6 v53.5,21.6 61.2,21.6 61.9,20.9 63.9,20.9 64.45,20.35 90.38,20.35 91.31,21.28 v93.58,21.28
D1  (via drill 0.3)
  Top 0.2: U6.12 34.75,20.29 | 34.75,20.29 35.31,20.29 36.4,19.2 36.4,13.8 36,13.4 36,10.8 35.5,10.3 35.5,8.35 34.15,7 v34.15,6.4 | v34.7,20.3 34.73,20.3 34.75,20.29 | U2.4 4.95,26.91 5.55,26.3 5.55,20.45 v5.8,20.2 | U4.12 53.48,20.29 v53.5,20.3 | U5.22 95.15,24.75 95.05,24.65 93.45,24.65 92.9,24.1 92.9,19.9 v93.1,19.9
  Bottom 0.2: PCB.B16 34.55,3.35 34.55,6 v34.15,6.4 | v5.8,20.2 5.95,20.35 34.65,20.35 v34.7,20.3 35.3,19.7 52.3,19.7 52.9,20.3 v53.5,20.3 60.8,20.3 61.52,19.58 92.78,19.58 v93.1,19.9
D2  (via drill 0.3)
  Top 0.2: 34.6,19.02 35.03,19.02 36,18.05 36,13.95 35.6,13.55 35.6,11.1 35.1,10.6 35.1,8.5 33.5,6.9 PCB.A17 | 34.6,19.02 U6.13 | v34.65,19 34.62,19 34.6,19.02 | v5.1,19.25 5.15,19.3 5.15,22.7 4.75,23.09 U2.7 | U4.13 52.23,19.1 v53.6,19.1 | U5.23 95.1,25.25 94.9,25.05 93.3,25.05 92.5,24.25 92.5,19.6 93.05,19.05 v93.1,19.05
  Bottom 0.2: v5.1,19.25 5.2,19.25 5.45,19 v34.65,19 35.25,18.4 52.3,18.4 53,19.1 v53.6,19.1 60.1,19.1 60.85,18.35 89.5,18.35 90.35,19.2 92.95,19.2 v93.1,19.05
D3  (via drill 0.3)
  Top 0.2: v42.6,15.1 42.8,15.3 42.8,20.2 42.88,20.29 v43.28,20.29 U6.15 | v35.4,14.25 35.19,14.04 35.19,11.31 34.48,10.61 v34.48,8.71 | v4.55,21.8 3.33,21.8 U2.8 | v62.5,20.3 63.84,20.3 U4.15 | U5.25 92.15,26.25 91.1,25.2 v91.1,20.25
  Bottom 0.2: v42.6,15.1 41.95,14.45 35.6,14.45 v35.4,14.25 | PCB.B17 33.5,6.92 34.48,7.91 v34.48,8.71 | v4.55,21.8 5.45,21.8 6.35,20.9 36.3,20.9 36.91,20.29 v43.28,20.29 52.38,20.29 53,20.9 61,20.9 61.6,20.3 v62.5,20.3 U4.15 64.19,19.96 90.81,19.96 v91.1,20.25
D4  (via drill 0.3)
  Top 0.2: PCB.A18 32.5,6 33.1,6.6 33.1,7.05 33.9,7.85 33.9,10.65 34.8,11.55 v34.8,14.85 | v42.2,15.9 42.2,21 42.76,21.55 v43.4,21.55 U6.16 | v9.5,22.2 9.88,21.82 U2.13 | v62.5,21.5 63.8,21.5 U4.16 | U5.26 92.05,26.75 90.7,25.4 90.7,21.5 v90.5,21.3
  Bottom 0.2: v42.2,15.9 41.15,14.85 v34.8,14.85 | v9.5,22.2 36.45,22.2 37.09,21.55 v43.4,21.55 52.05,21.55 52.7,22.2 61.8,22.2 v62.5,21.5 63.9,21.5 64.65,20.75 89.95,20.75 v90.5,21.3
D5  (via drill 0.3)
  Top 0.2: v43.9,13.35 43.9,17.3 44.35,17.75 U6.17 44.91,17.8 v46.2,17.8 | v32.5,7 32.5,7.1 33.5,8.1 33.5,10.8 34.15,11.45 v34.15,12.8 | v62.5,17.7 63.8,17.7 U4.17 | U5.27 91.95,27.25 90.25,25.55 90.25,22 89.9,21.65 89.9,19.35 v90.65,18.6 | v11.7,15.2 11.7,19.6 11.4,19.9 9.5,19.9 8.75,20.65 8.75,22.3 9.55,23.09 U2.14
  Bottom 0.2: v43.9,13.35 36.75,13.35 36.65,13.25 34.6,13.25 v34.15,12.8 33.85,12.5 20.8,12.5 18.4,14.9 12,14.9 v11.7,15.2 | PCB.B18 v32.5,7 | v46.2,17.8 62.4,17.8 v62.5,17.7 89.45,17.7 90.35,18.6 v90.65,18.6
D6  (via drill 0.3)
  Top 0.2: v43.2,14 43.2,18.85 43.37,19.02 v43.38,19.02 U6.18 | PCB.A19 31.5,6.9 33.1,8.5 33.1,11 33.55,11.45 33.55,13.05 v34.15,13.65 | v38,24 38,19.15 v37.95,19.1 | v9.12,24.2 9.12,26.71 9.4,27 10.61,27 U2.17 | v62.5,19 63.84,19 U4.18 | U5.28 95.15,27.75 95.05,27.65 91.75,27.65 89.85,25.75 89.85,22.11 89.5,21.77 89.5,20.82 89.25,20.57 v89.25,18.96
  Bottom 0.2: v43.2,14 36.6,14 36.25,13.65 v34.15,13.65 | v37.95,19.1 38.03,19.02 v43.38,19.02 52.31,19.02 53,19.7 60.4,19.7 61.1,19 v62.5,19 89.22,19 v89.25,18.96 | v38,24 9.31,24 v9.12,24.2
D7  (via drill 0.3)
  Top 0.2: v41.4,16.1 41.4,21.48 42.75,22.82 U6.19 v43.4,22.82 | v34.2,15.45 34.2,14.65 33.1,13.55 33.1,11.65 32.6,11.15 32.6,8.85 v32.5,8.75 | v8.38,22.85 8.38,27.63 8.95,28.2 10.68,28.2 U2.18 | U4.19 62.52,22.82 v62.5,22.8 | U5.29 95,28.25 94.85,28.1 91.6,28.1 89.47,25.97 89.47,22.28 88.87,21.68 v88.87,21.33
  Bottom 0.2: v41.4,16.1 40.75,15.45 v34.2,15.45 | v32.5,8.75 31.5,7.75 PCB.B19 | v8.38,22.85 8.41,22.82 v43.4,22.82 43.42,22.8 v62.5,22.8 63.2,22.1 63.95,22.1 64.9,21.15 88.69,21.15 v88.87,21.33
GND  (via drill 0.3)
  Top 0.2: C8.- v63.8,44
  other vias: 30.5,6.3 30.5,6.9 30.5,7.5 94.55,25.65 93.85,25.65 44.5,6.3 44.5,7 44.5,7.7 35.55,6.45 35.95,7.2 36.5,7.75 83.85,27.4 44.9,12.1 45.6,12.1 47.3,14.5 48,17 47.7,22.2 47.7,24 47.8,34.3 47.8,35.6 47.8,37.4 51.8,37.4 42,37.4 34.7,37.4 22.9,35.7 6.9,42.7 6.9,41.9 67.3,39.6 77.2,49 62.9,49 53.6,49 19.4,49 5.6,49.1 1,48.9 0.8,42.6 0.9,11.4 1,3.1 6.9,3.1 7.7,6 12,9.9 16,9.9 18.5,7.7 21.4,6.3 15.4,17.2 21.5,16.3 17.5,19.7 33.1,16.5 31.5,11.5 32.3,13.2 38.4,12.7 38,16.3 41.6,12.7 41.9,9.7 49.7,7.4 54,9.8 63.9,9.8 67.6,6.6 89.9,5.9 97.1,9.6 99.2,20 95.8,19.9 85,12.5 87.9,24.8 88.2,29.1 90.7,29.3 92.5,31.7 89.4,31.7 86.4,31.7 85.6,29.1 81.6,32.6 81.1,35.7 75.3,35.7 73.9,39.6 71,29.8 70.2,28.5 65.7,31.1 65.9,34.3 65.8,32.4 58.4,34.3 57.2,35.6 65.3,37.7 83.5,42.8 87.9,40.3 92.2,37.7 96.5,35.5 57.4,24 38.9,24 38.9,22.2 19.1,23.4 66.2,25 72.1,17 76,32.4 71.2,34.3 57.2,18.5 57.2,17.1 52.1,16.8 68,17 72.2,32.4 74.6,14.6 68.8,12.5 71.7,12.1 66.2,23.25 65.7,28.3 71.2,35.7 69.9,35.7 69.9,34.3 84.4,23.8 84.5,21.8 76.3,23.3 17.2,34 5.3,34 1.9,19.3 9.3,32.4 21.8,31.9 99.2,15 21.8,29.9 65.5,44 59.5,41.3 58,41.3 63.5,41.3 6.9,41.1 9.8,36.9 18.2,36.9 20.6,41.3 19,41.3 37.4,41.3 41.9,40.7 53.3,41.3 45.9,40.6 55.6,39.6 61.7,39.6 38.9,26.6 61.5,24.1 88.7,35 97.15,22.95 93.15,25.65 91.85,18.55 91.85,20.65
  pour Top (rank 5): 1,2 0,3 0,49 1,50 6,50 8,48 17,48 19,50 54,50 55,49 60,49 61,50 65,50 66,49 72,49 73,50 82.92,50 100,39.96 100,9.94 90,4.96 68,5 64,9 54,9 52,7 52,5 18,5 18,7 16,9 12,9 8,5 8,3 7,2
  pour Bottom: 44.3,2.8 44.7,2.8 44.7,5.7 44.9,5.9 44.9,7.3 43.8,7.3 43.8,5.9 44.3,5.4
  pour Bottom (rank 5): 1,2 0,3 0,49 1,50 6,50 8,48 17,48 19,50 54,50 55,49 60,49 61,50 65,50 66,49 72,49 73,50 82.92,50 100,39.96 100,9.94 90,4.96 68,5 64,9 54,9 52,7 52,5 18,5 18,7 16,9 12,9 8,5 8,3 7,2
  pour Top (rank 3): 82.21,49.62 98.66,40.12 96.36,36.14 79.91,45.64
N$1
  Top 0.2: U3.17 U3.16
N$2  (via drill 0.3)
  Top 0.2: v81.15,37 R1.1
  Bottom 0.2: LED1.A 88.22,36.98 87,38.2 82.35,38.2 v81.15,37
N$3  (via drill 0.3)
  Top 0.2: R2.1 v81.25,38.2
  Bottom 0.2: v81.25,38.2 81.85,38.8 88.54,38.8 LED2.A
N$4  (via drill 0.3)
  Top 0.2: R10.2 87.65,37 90.55,34.1 90.55,30.05 88.05,27.55 v88.05,26.9 | RAM0.A v98.2,24.25
  Bottom 0.2: v88.05,26.9 88.25,26.7 95.75,26.7 v98.2,24.25
N$5  (via drill 0.3)
  Top 0.2: R3.1 81.2,39.4 v81.25,39.45
  Bottom 0.2: v81.25,39.45 83.86,39.45 84.88,40.48 LED3.A
N$6  (via drill 0.3)
  Top 0.2: R4.1 v81.25,40.6
  Bottom 0.2: v81.25,40.6 80.55,41.3 LED4.A
N$7  (via drill 0.3)
  Top 0.2: ROM.A 98,30.1 98,30.4 97.5,30.9 v97.5,33.4 | v90.8,34.8 90.4,34.8 87.8,37.4 85.05,37.4 R11.2
  Bottom 0.2: v97.5,33.4 97.3,33.6 92.3,33.6 91.1,34.8 v90.8,34.8
N$8  (via drill 0.3)
  Top 0.2: R12.2 v87.3,35.8 | RAM1.A 99,21.35 99.45,21.8 99.45,33.8 99.2,34.05 v99.15,34.05
  Bottom 0.2: v87.3,35.8 90.7,35.8 92.45,34.05 v99.15,34.05
N$9  (via drill 0.3)
  Top 0.2: v96.1,11.6 96.1,13.69 97.6,15.19 B1_ROE.1
  Bottom 0.2: PCB.B5 47.5,8.1 50.2,10.8 66.4,10.8 67.6,9.6 84,9.6 85.8,11.4 95.9,11.4 v96.1,11.6
N$10  (via drill 0.3)
  Top 0.2: PCB.A5 47.5,7.2 v48.1,7.8 | v97.5,11 97.6,11.1 ROM_WE.1
  Bottom 0.2: v48.1,7.8 48.1,8.2 50.3,10.4 66.2,10.4 67.4,9.2 84.2,9.2 86,11 v97.5,11
VCC  (via drill 0.3)
  Top 0.2: U5.8 84.15,26.25 85.3,27.4
  Top 0.4: 39.75,43.25 C6.1 39.75,35.55 41.05,34.26 U6.28 | R6.2 44.15,43.15 | U4.28 60.15,34.26 58.75,35.65 C4.1 58.75,43.55 | 19.75,44.05 C3.1 19.75,32.05 21.09,30.71 U3.20 | U2.20 9.19,30.71 7.75,32.15 C2.1 7.75,39.15 11.5,42.9 | C8.+ 69.74,42.4 70.54,41.6 76.25,41.6 R4.2 R3.2 R2.2 R1.2 77.25,34.65 77.2,34.6 | U1.20 74.98,31.71 73.75,32.95 C1.1 77.2,34.6 | 82.8,34.6 87.8,34.6 88.25,34.15 C5.1 88.25,30.35 85.3,27.4 | 82.8,34.6 77.2,34.6 | R11.1 R10.1 R12.1 82.8,35.75 82.8,34.6 | R5.2 82.75,34.55 82.8,34.6
  other vias: 45.65,6.3 46.35,6.3 46.35,7 45.65,7
  pour Top (rank 3): 48.9,12.1 48.9,39.7 46.6,42 10.6,42 10.6,45.9 70.1,45.9 70.1,41.95 53.06,41.95 50.7,39.59 50.7,11.1 46.7,7.1 46.7,2.6 46.4,2.6 46.4,3.6 45.8,3.6 45.8,2.8 45.6,2.6 45.3,2.6 45.3,8.5
  pour Bottom: 45.3,2.4 45.3,7.3 46.7,7.3 46.7,2.4 46.4,2.4 46.4,3.6 45.8,3.6 45.8,2.4

### Text on the board
tPlace: ROM + SRAM | 32kB 64kB | Kleio-360i | PN: MMS.K360I.0002
bPlace: Kleio-360i | Designed in Orbit by / Mnemosyne Memory Systems, GmbH | A division of SenseNet Technologies | WARNING | For OnoSendai Cyberspace-1 System Only! | PN: MMS.K360I.0002
tStop: MEMORY
tRestrict: MEMORY